# Altium project H2_transmitter_v4.PrjPcb
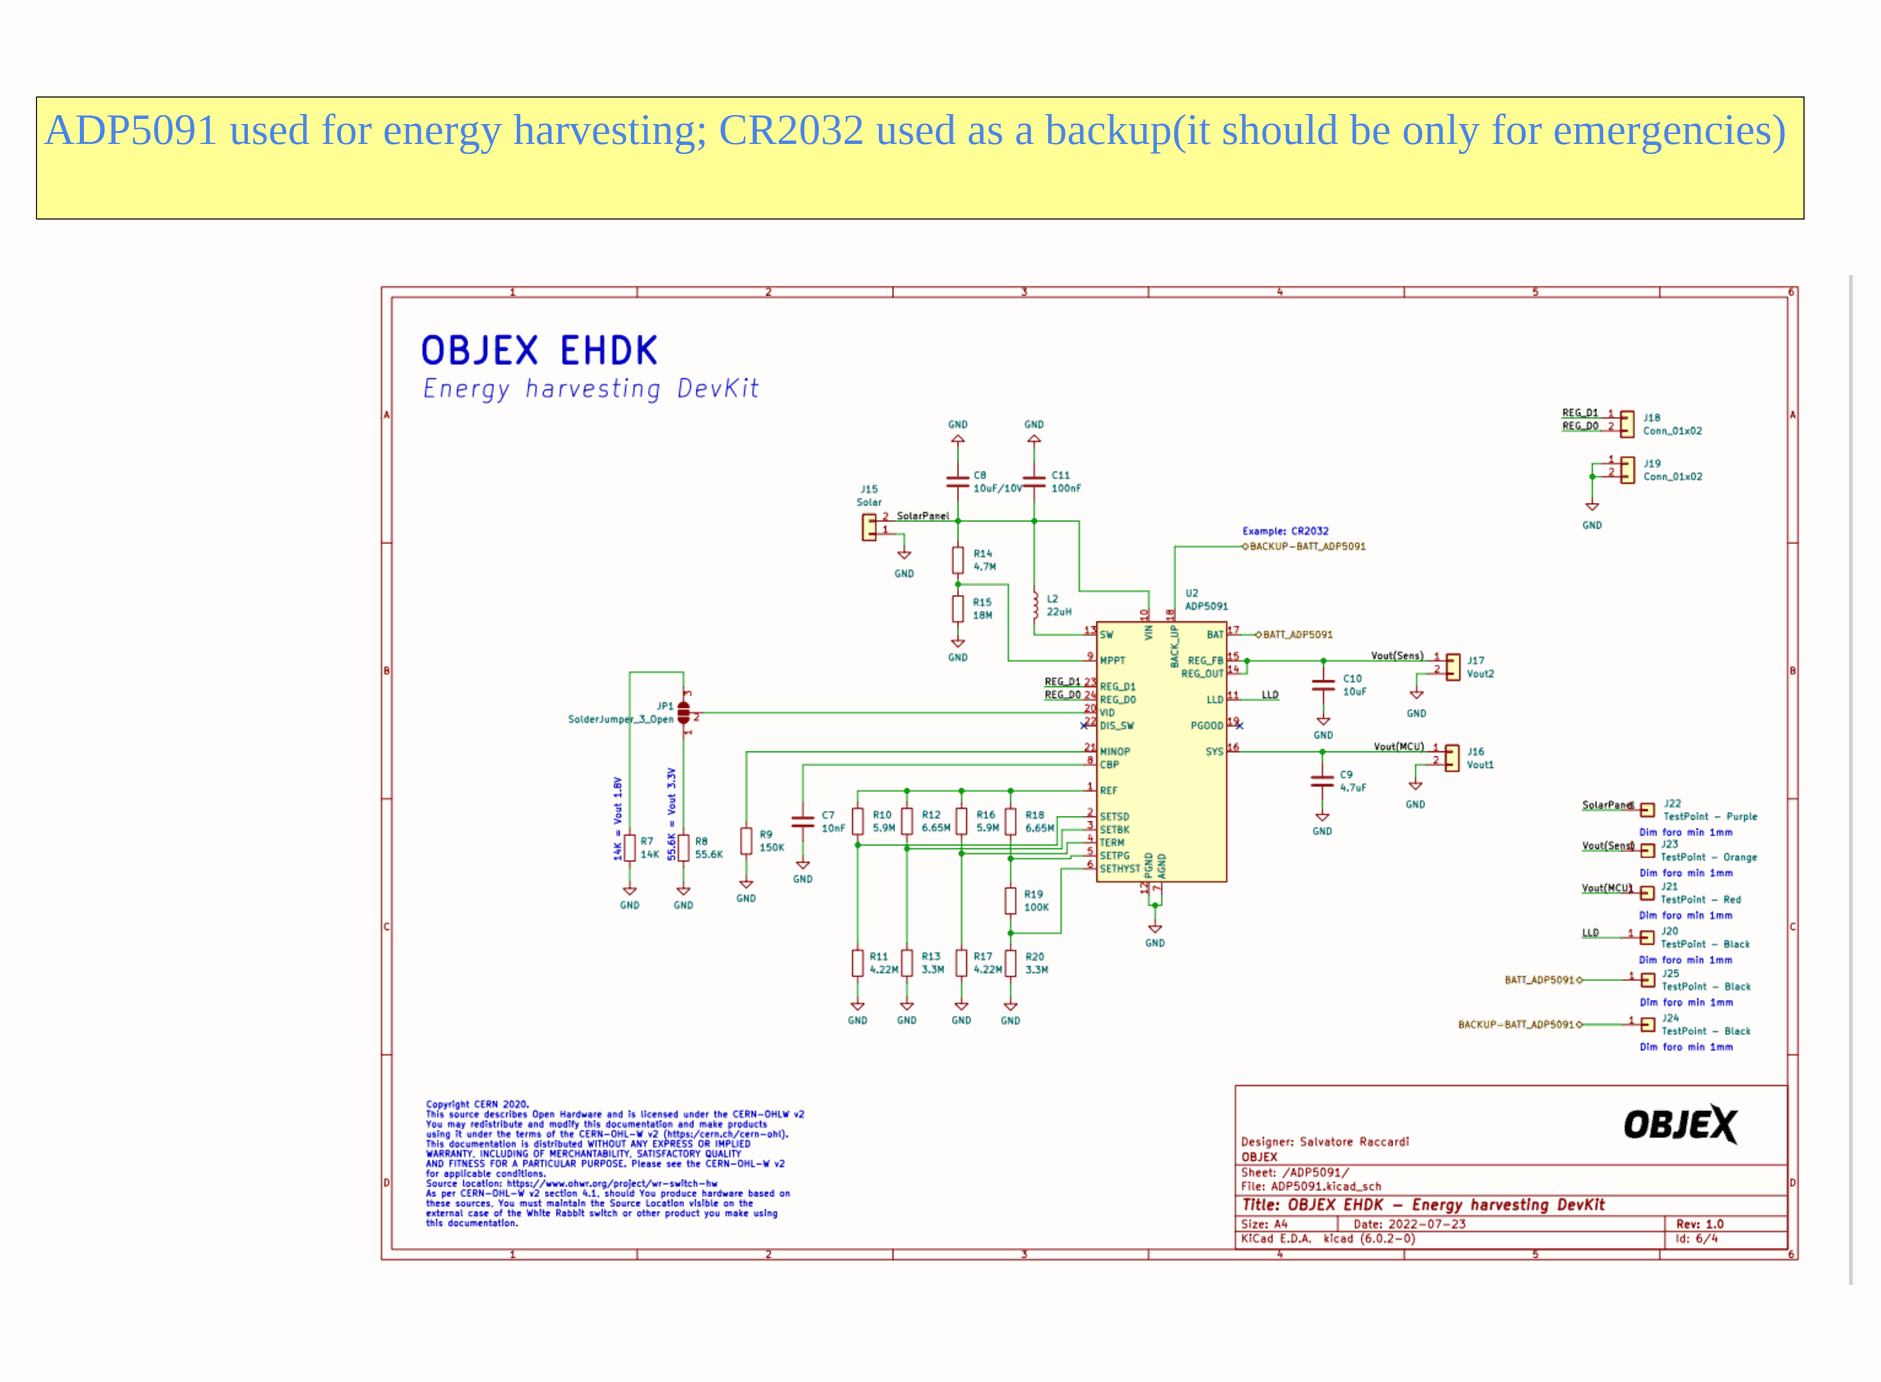
[diagram p0: 1_Power.SchDoc, left]
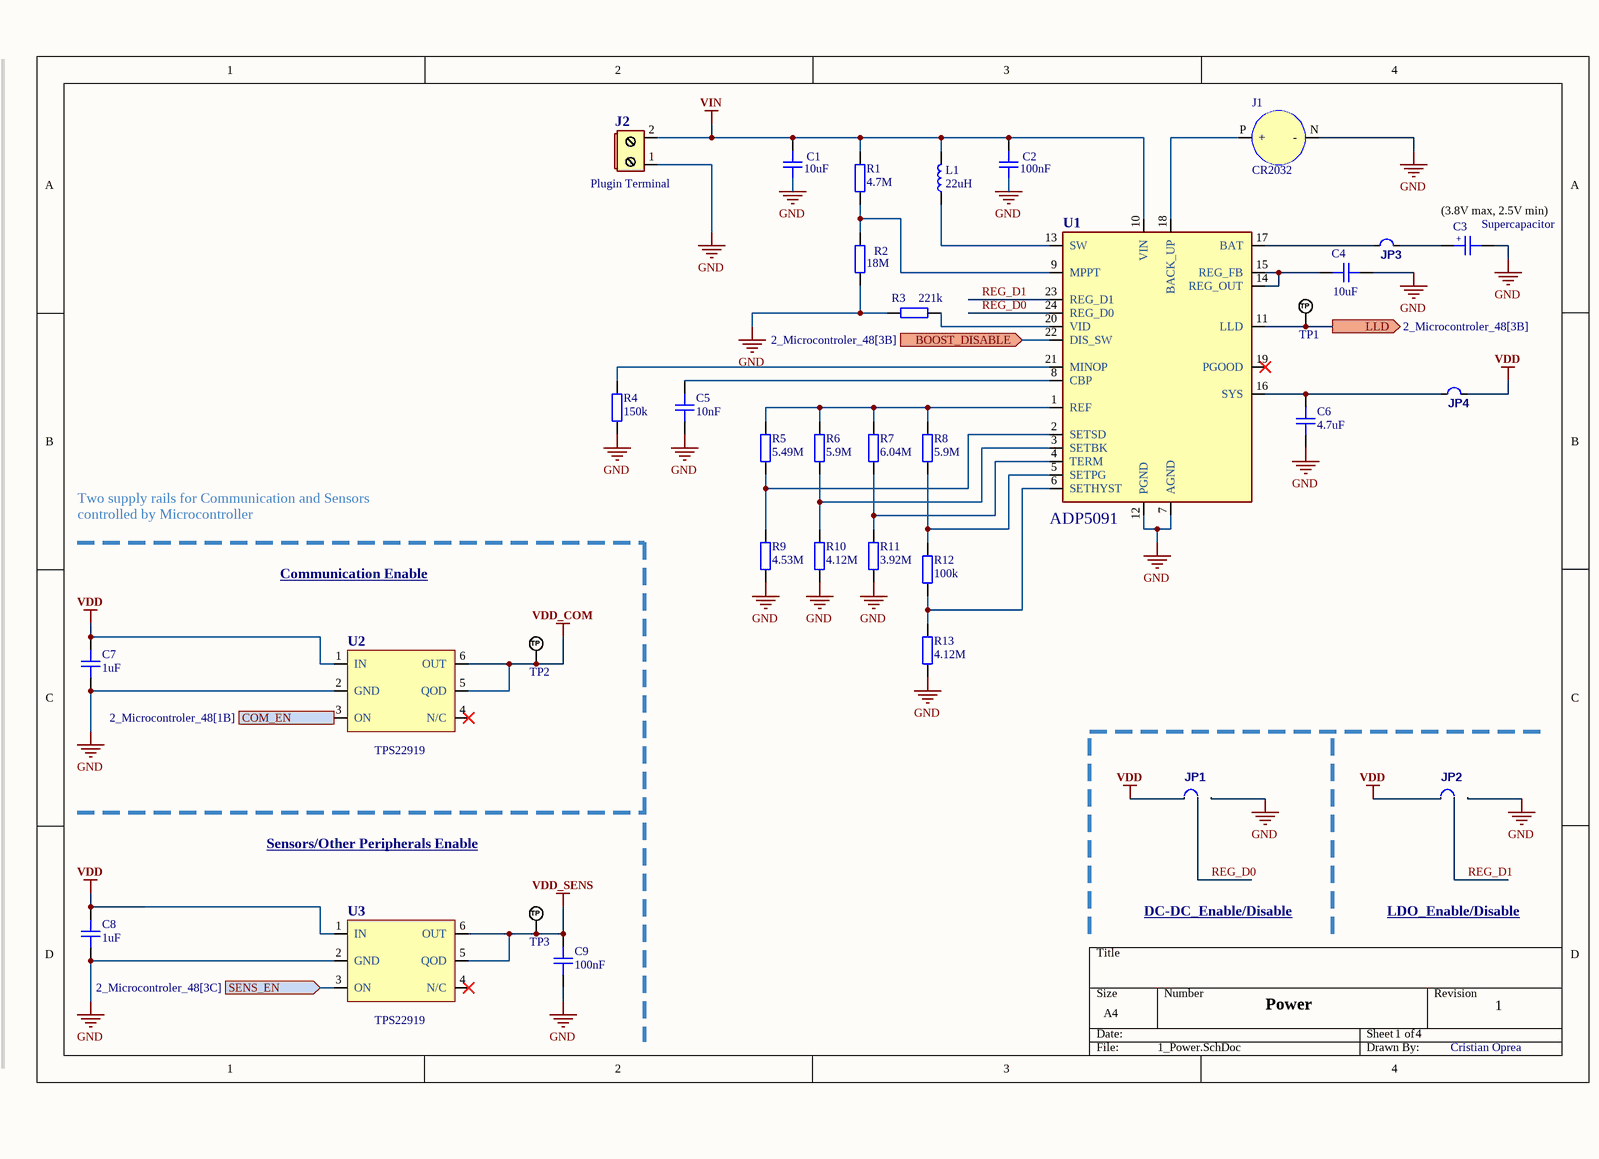
[diagram p1: 1_Power.SchDoc, middle]
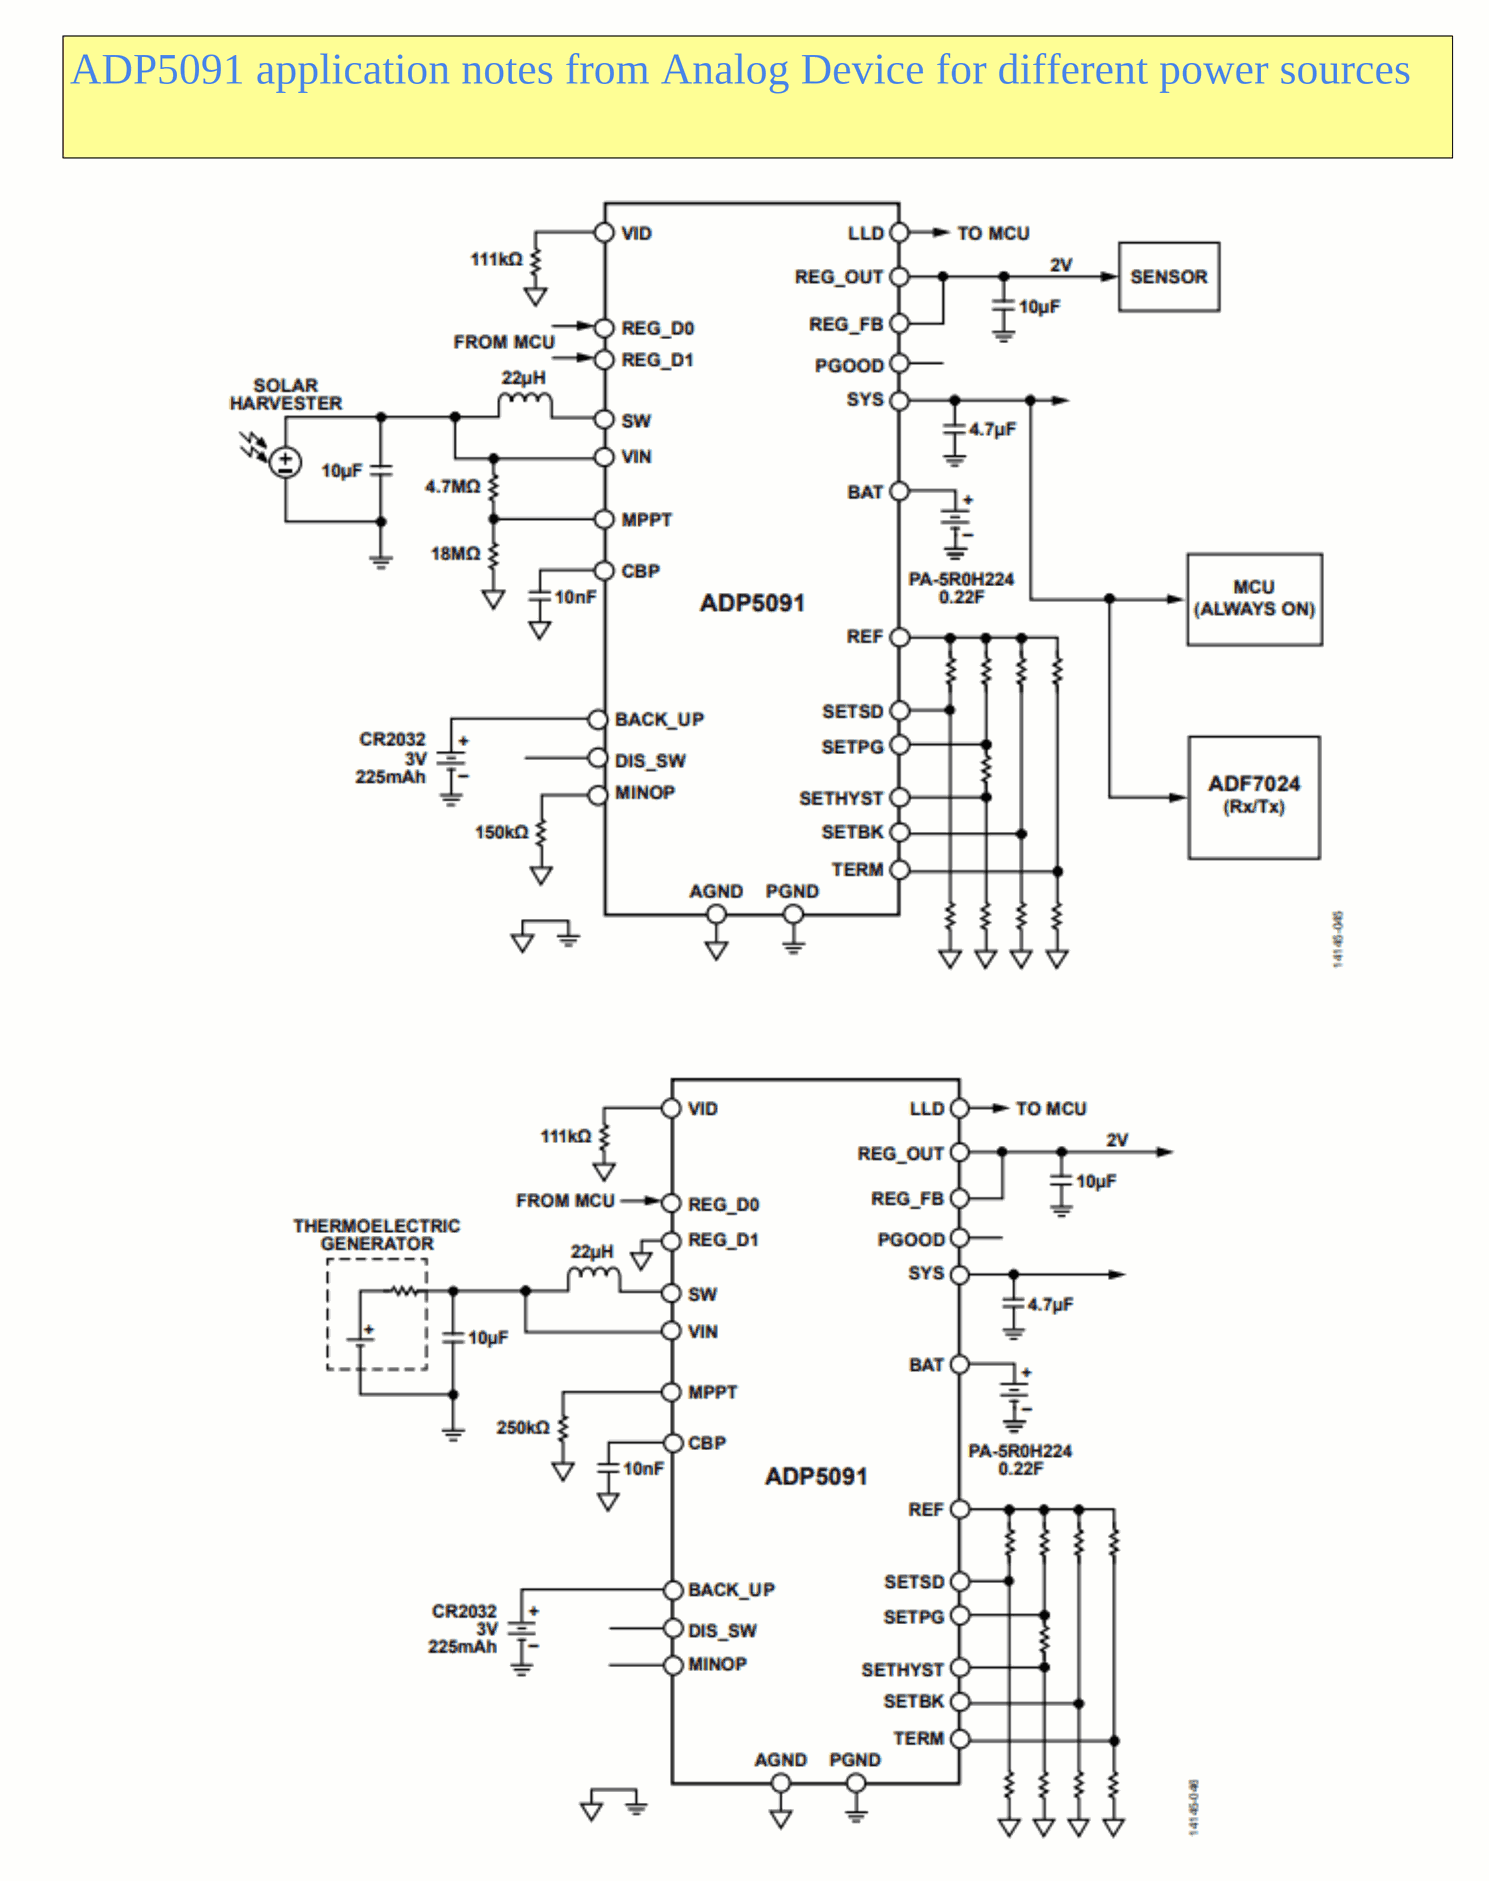
[diagram p2: 1_Power.SchDoc, right]
2 sheets, 58 parts. Net scope: flat (ports and power ports of the same name join across sheets).
Board file: PCB1.PcbDoc
Sheets:
  1_Power.SchDoc
  3_Communication.SchDoc

## Sheet 1_Power.SchDoc: Power
size A4; DrawnBy: Cristian Oprea; Revision: 1; SheetNumber: 1; SheetTotal: 4

### Parts
C1  10uF  [C0603]
C2  100nF  [C0603]
C3  Supercapacitor  [CAP_POL_8x16x3.5]
C4  10uF  [C0603]
C5  10nF  [C0603]
C6  4.7uF  [C0603]
C7  1uF  [C0603]
C8  1uF  [C0603]
C9  100nF  [C0603]
J1  CR2032  [BAT_CR2032-BS-6-1]
J2  Plugin Terminal  [2.54_pluggable_terminal]
JP1  JUMPER_3PIN  [HEADER_1x3_2.54]  (value not drawn)
JP2  JUMPER_3PIN  [HEADER_1x3_2.54]  (value not drawn)
JP3  JUMPER  [HEADER_1x2_2.54]  (value not drawn)
JP4  JUMPER  [HEADER_1x2_2.54]  (value not drawn)
L1  22uH  [IND_3.2_4]
R1  4.7M  [R0603]
R2  18M  [R0603]
R3  221k  [R0603]
R4  150k  [R0603]
R5  5.49M  [R0603]
R6  5.9M  [R0603]
R7  6.04M  [R0603]
R8  5.9M  [R0603]
R9  4.53M  [R0603]
R10  4.12M  [R0603]
R11  3.92M  [R0603]
R12  100k  [R0603]
R13  4.12M  [R0603]
TP1  TP_NOBOM  [TEST_PAD_THD]  (value not drawn)  (no BOM)
TP2  TP_NOBOM  [TEST_PAD_THD]  (value not drawn)  (no BOM)
TP3  TP_NOBOM  [TEST_PAD_THD]  (value not drawn)  (no BOM)
U1  ADP5091  [LFCSP-24]
U2  TPS22919  [SC70-6]
U3  TPS22919  [SC70-6]

### Ports
BOOST_DISABLE (in, see 2_Microcontroler_48[3B]), COM_EN (in, see 2_Microcontroler_48[1B]), LLD (out, see 2_Microcontroler_48[3B]), SENS_EN (in, see 2_Microcontroler_48[3C])

### Nets
GND: C1.1 C2.1 C3.2 C4.2 C5.1 C6.1 C7.1 C8.1 C9.1 J1.N(-) J2.1 JP1.3 JP2.3 R2.1 R3.1 R4.1 R9.1 R10.1 R11.1 R13.1 U1.7(AGND) U1.12(PGND) U2.2(GND) U3.2(GND)
VDD: C7.2 C8.2 JP1.1 JP2.1 JP4.2 U2.1(IN) U3.1(IN)
VDD_COM: TP2.1(TP) U2.5(QOD) U2.6(OUT)
VDD_SENS: C9.2 TP3.1(TP) U3.5(QOD) U3.6(OUT)
VIN: C1.2 C2.2 J2.2 L1.2 R1.2 U1.10(VIN)
REG_D0: JP1.2 U1.24(REG_D0)
REG_D1: JP2.2 U1.23(REG_D1)
NetC3_1: C3.1 JP3.2
NetC4_1: C4.1 U1.14(REG_OUT) U1.15(REG_FB)
NetC5_2: C5.2 U1.8(CBP)
NetC6_2: C6.2 JP4.1 U1.16(SYS)
NetJ1_P: J1.P(+) U1.18(BACK_UP)
NetJP3_1: JP3.1 U1.17(BAT)
NetL1_1: L1.1 U1.13(SW)
NetR1_1: R1.1 R2.2 U1.9(MPPT)
NetR3_2: R3.2 U1.20(VID)
NetR4_2: R4.2 U1.21(MINOP)
NetR5_1: R5.1 R9.2 U1.2(SETSD)
NetR5_2: R5.2 R6.2 R7.2 R8.2 U1.1(REF)
NetR6_1: R6.1 R10.2 U1.3(SETBK)
NetR7_1: R7.1 R11.2 U1.4(TERM)
NetR8_1: R8.1 R12.2 U1.5(SETPG)
NetR12_1: R12.1 R13.2 U1.6(SETHYST)
NetTP1_1: TP1.1(TP) U1.11(LLD) ; port LLD
NetU1_22: U1.22(DIS_SW) ; port BOOST_DISABLE
NetU2_3: U2.3(ON) ; port COM_EN
NetU3_3: U3.3(ON) ; port SENS_EN

Not connected (* = marked no-connect by the designer): U1 19(PGOOD)*; U2 4(N/C)*; U3 4(N/C)*

### Notes on the sheet
- ADP5091 application notes from Analog Device for different power sources
- ADP5091 used for energy harvesting; CR2032 used as a backup(it should be only for emergencies)
- (near J2) 0.08V to 3.6V input
- R1 not populated for TEG generators
- (near C3) (3.8V max, 2.5V min)
- VID resistor for setting output voltage
- Low Light Density (low voltage at input), PGOOD is HIGH only when output voltage is higher than the set voltage
- Two supply rails for Communication and Sensors controlled by Microcontroller
- Vsetbk = 2.4V (backup supply swith on threshold)(higher than stop discharge threshold)
- (near R11) Vbat_term = 3.8V (stop charge threshold) (hybrid supercapacitor with lithium)
- Communication Enable
- Vsetsd = 2.2V (stop discharge threshold) (hybrid supercapacitor with lithium)
- Vsetbkhys = (hysteresis threshold)
- (near JP4) Floating: VOUT = 2.5 V
  RVID = 7 kΩ: VOUT = 1.5 V
  RVID = 14 kΩ: VOUT = 1.8 V
  RVID = 27.7 kΩ: VOUT = 3.6 V
  RVID = 55.6 kΩ:VOUT = 3.3 V
  RVID = 111 kΩ: VOUT = 2.0 V
  RVID = 221 kΩ: VOUT = 3.0 V
  RVID = 442 kΩ: VOUT = 2.8 V
- (near R13) Vsetpg = 2.4V (power good threshold) (voltage output is higher than this threshold)
- Sensors/Other Peripherals Enable
- DC-DC_Enable/Disable
- LDO_Enable/Disable
- (in symbol Supercapacitor) +

### Library data of the parts
C1 C2 C4-C9 = CAP_0603: Capacitor SMD 0603; Manufacturer: *; Manufacturer Part Number: *; Distributor Link: *; LCSC: *; Rating: *; Dielectric: *
J1 = CR2032-BS-6-1: CR2032 Coin Cell Battery Holder; Manufacturer: Q&J; Manufacturer Part Number: CR2032-BS-6-1
J2 = Power_Connector: Screw terminal or plug terminal for power
JP1 JP2 = JUMPER_3PIN: *; PackageReference: *; Manufacturer Part Number 1: *
JP3 JP4 = JUMPER: *; PackageReference: *; Manufacturer Part Number 1: *
L1 = IND_1008: Inductor SMD 1008
R1-R13 = RES_0603: Resistor SMD 0603; Manufacturer: *; Manufacturer Part Number: *; Distributor Link: *; LCSC: *
TP1-TP3 = TEST_POINT_RND_1MM: Test Point Round 1mm (NO BOM)
U1 = ADP5091: Ultralow Power Energy Harvester PMUs / with MPPT and Charge Management and BAckup Supply
U2 U3 = TPS22919: 5.5-V, 1.5-A, 90-mΩ load switch with adjustable output discharge
C3 = Supercapacitor: Manufacturer: *; Manufacturer Part Number: *; Distributor Link: *; LCSC: *

## Sheet 3_Communication.SchDoc: Communication
size A4; DrawnBy: Cristian Oprea; Revision: 1; SheetNumber: 3; SheetTotal: 4
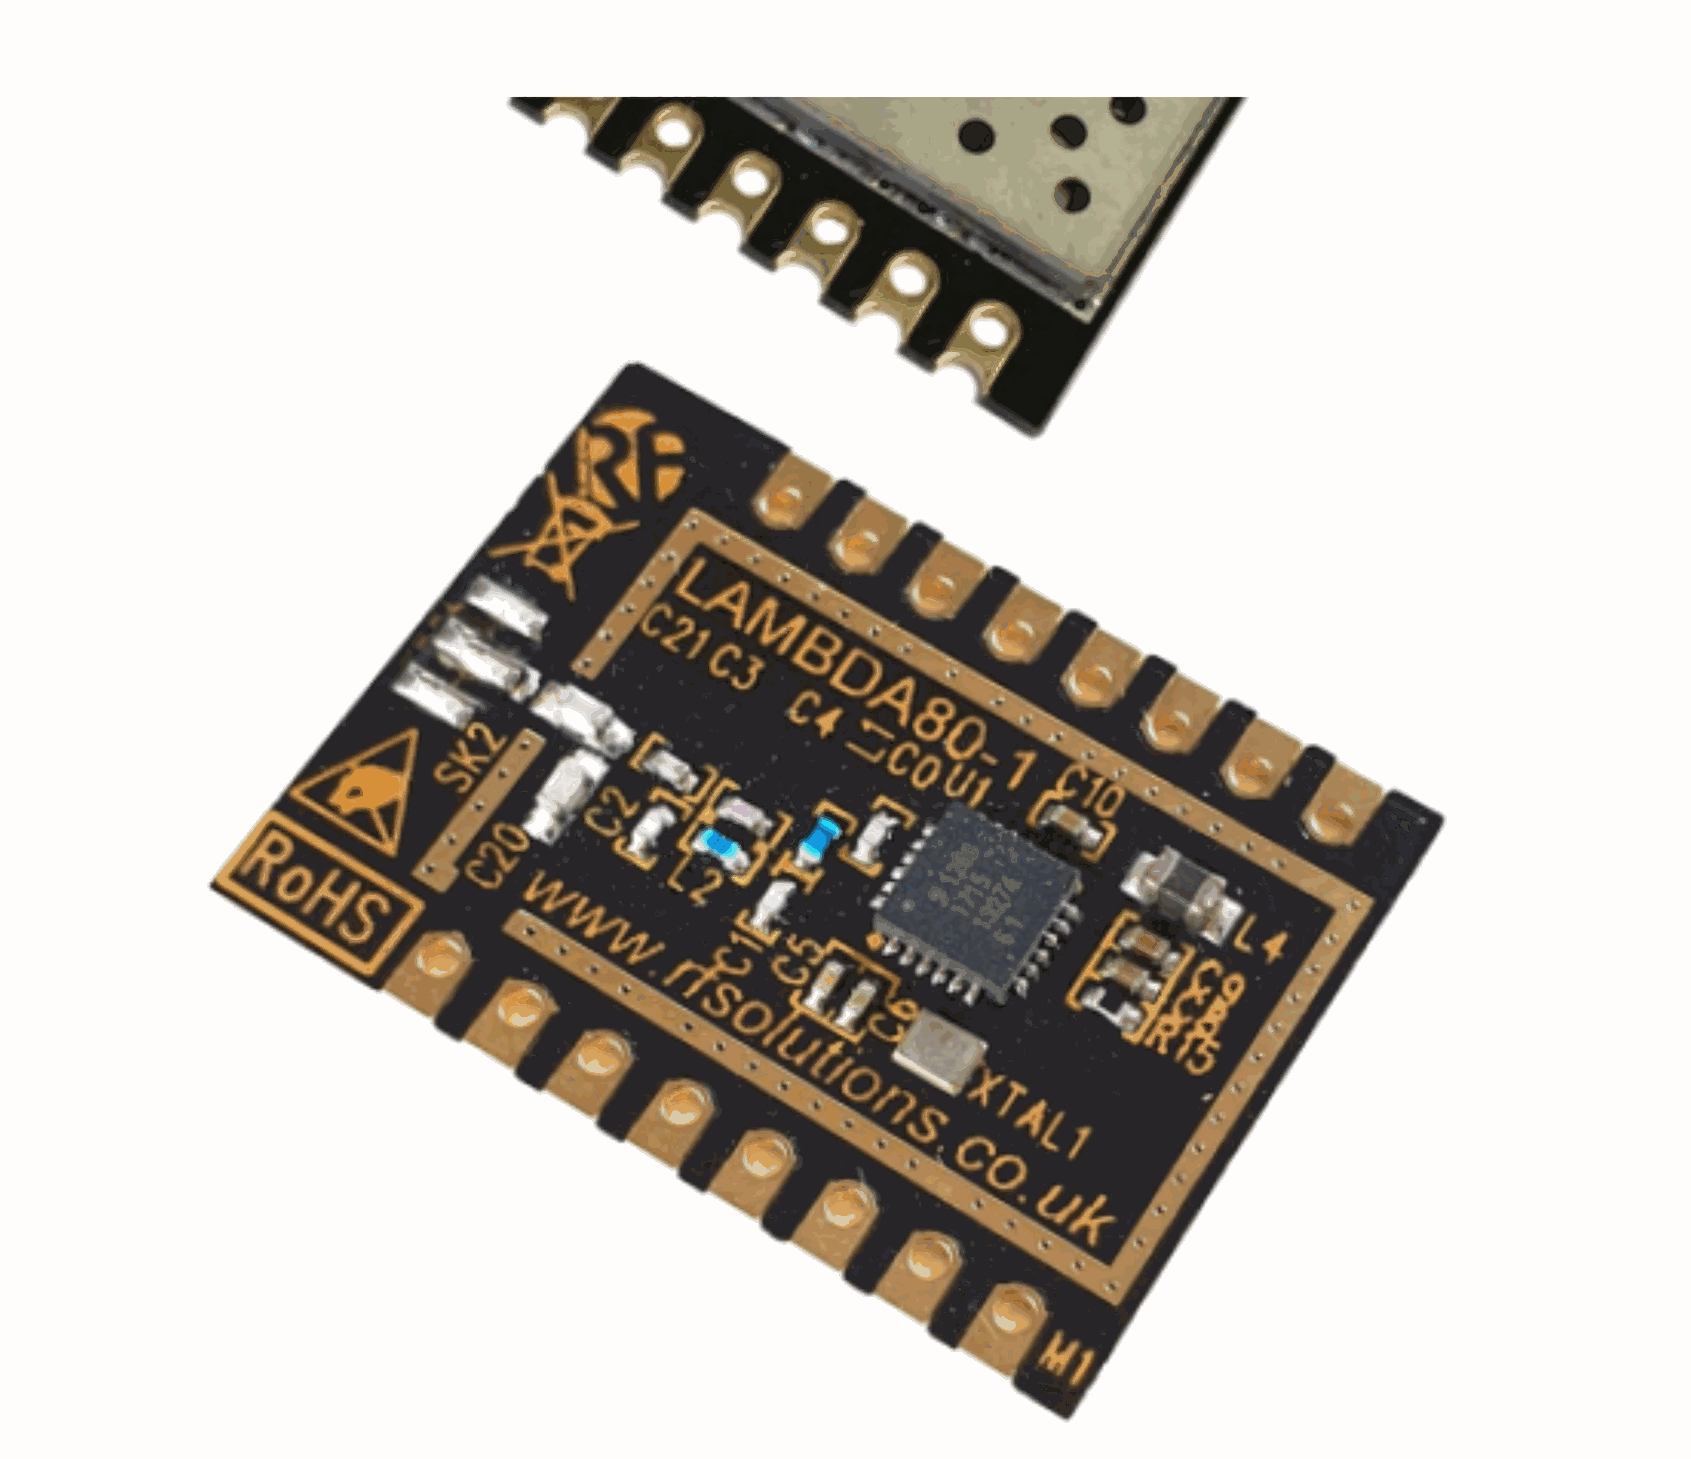
[diagram p3: 3_Communication.SchDoc, top middle]
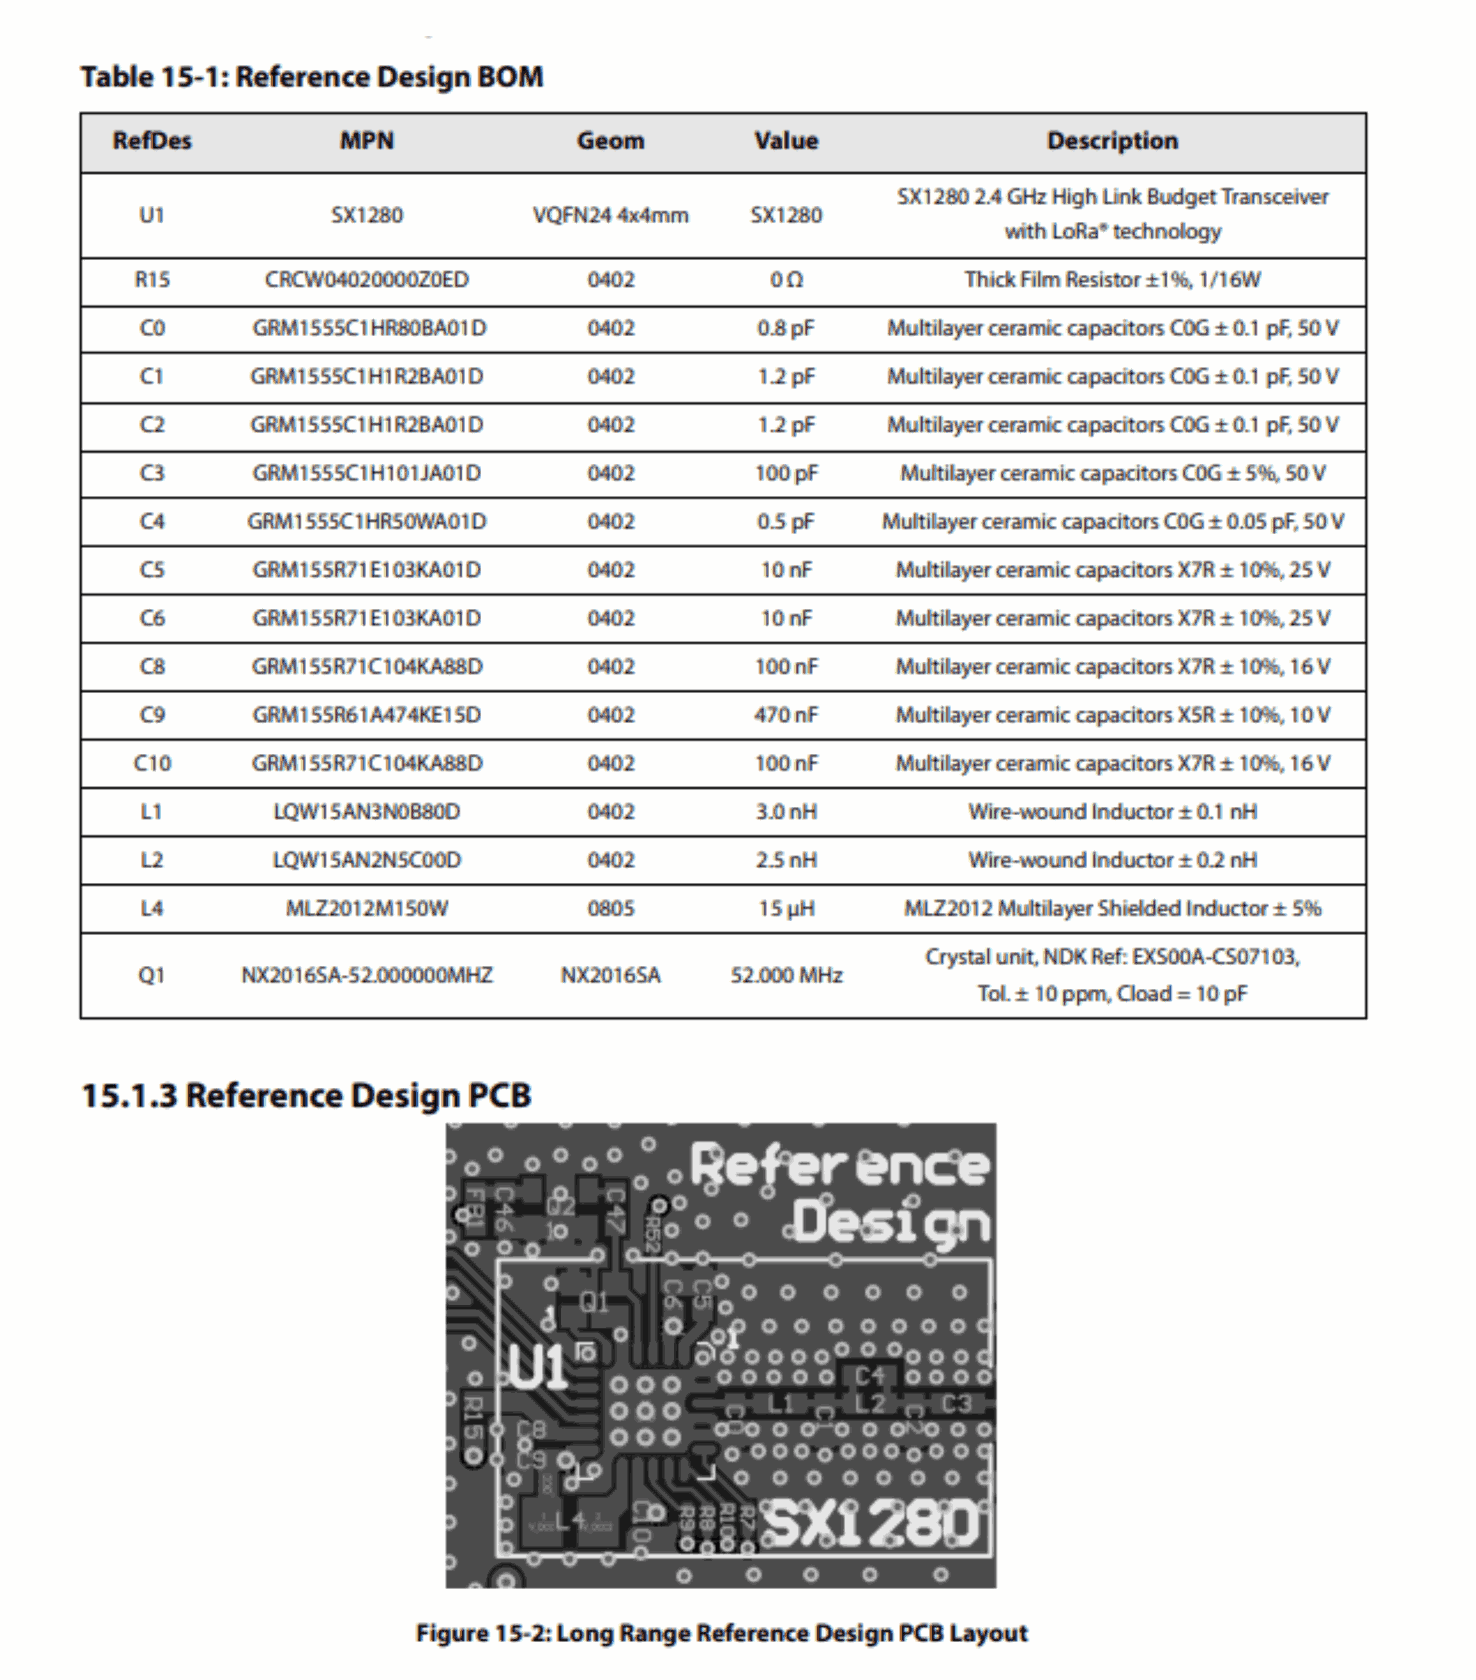
[diagram p4: 3_Communication.SchDoc, top right]
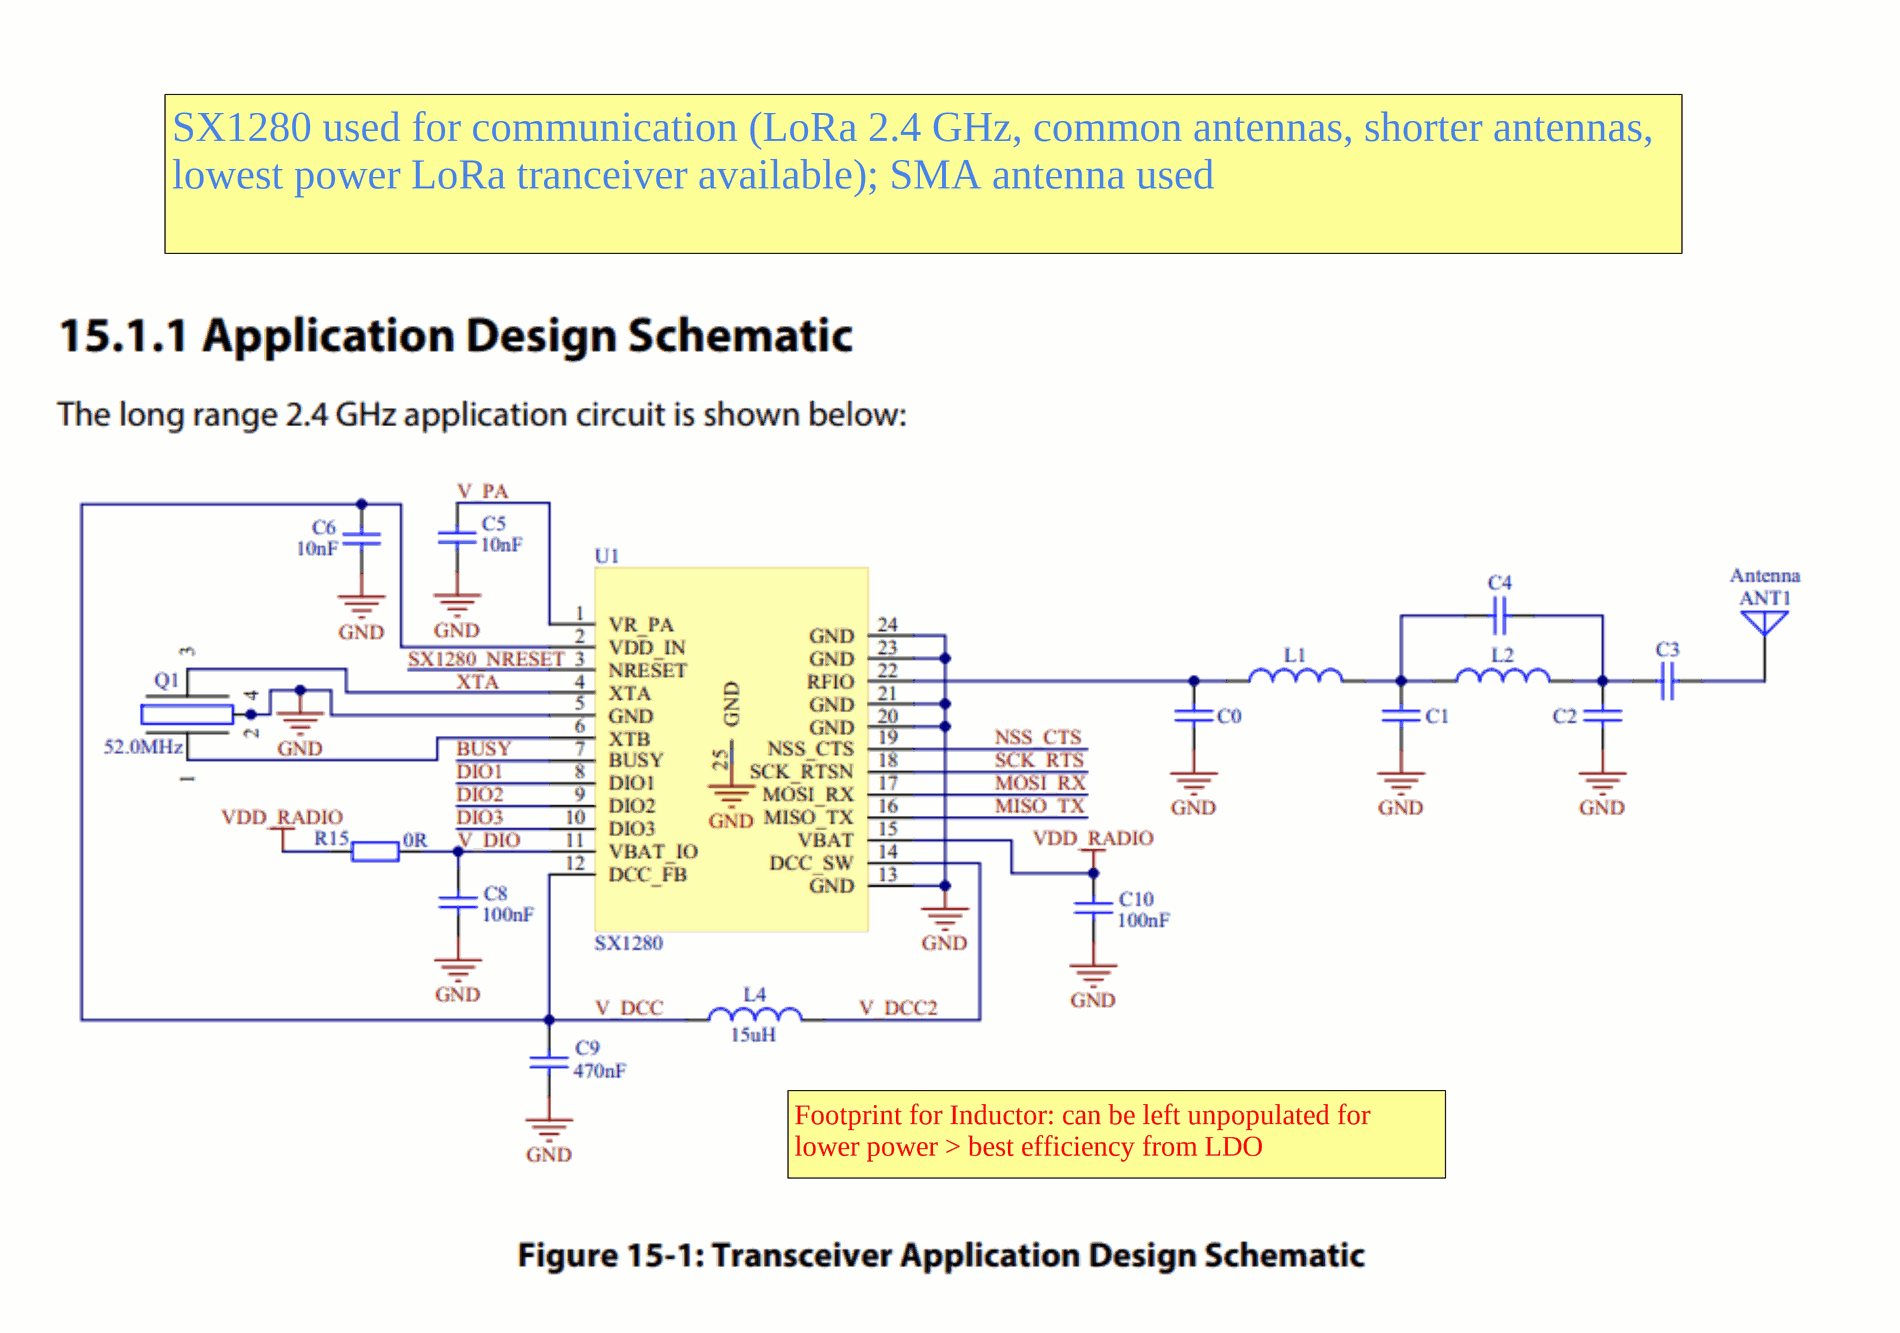
[diagram p5: 3_Communication.SchDoc, bottom left]
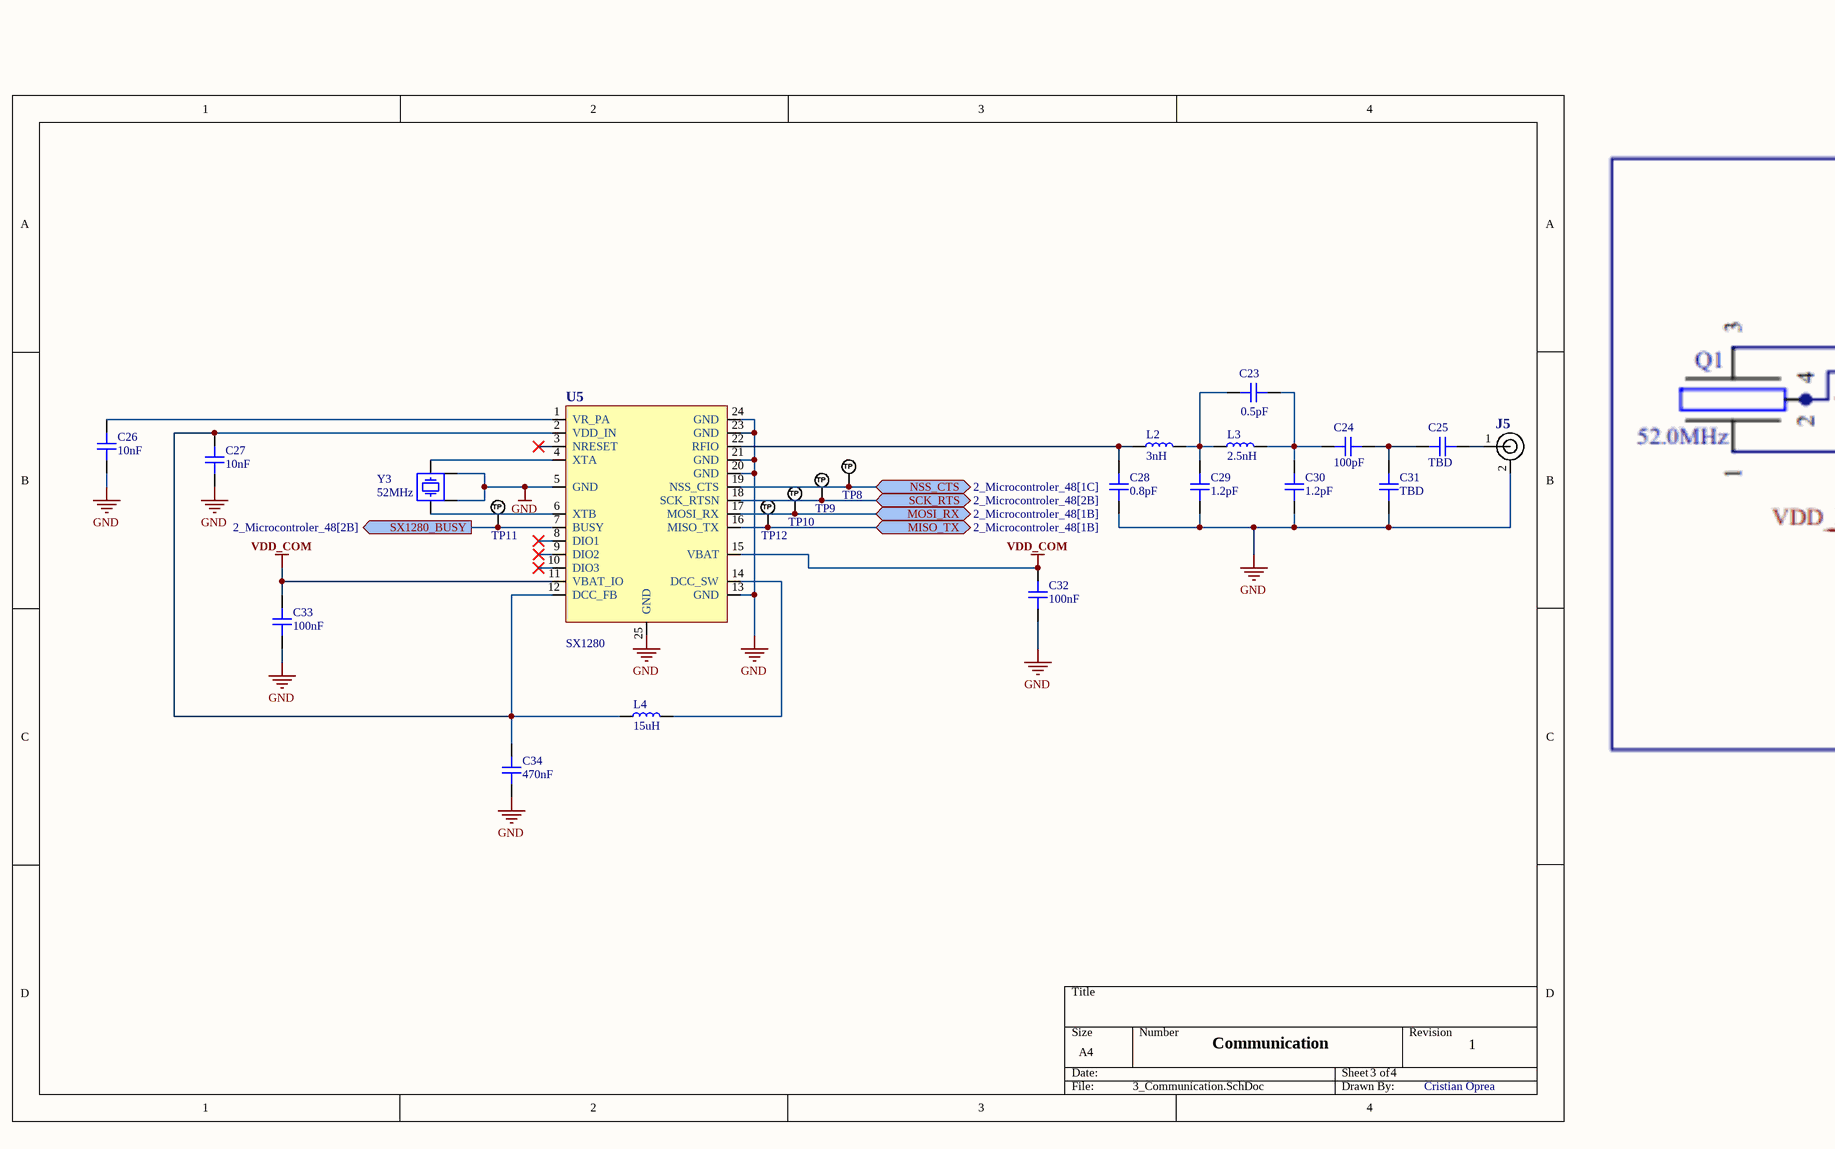
[diagram p6: 3_Communication.SchDoc, bottom middle]
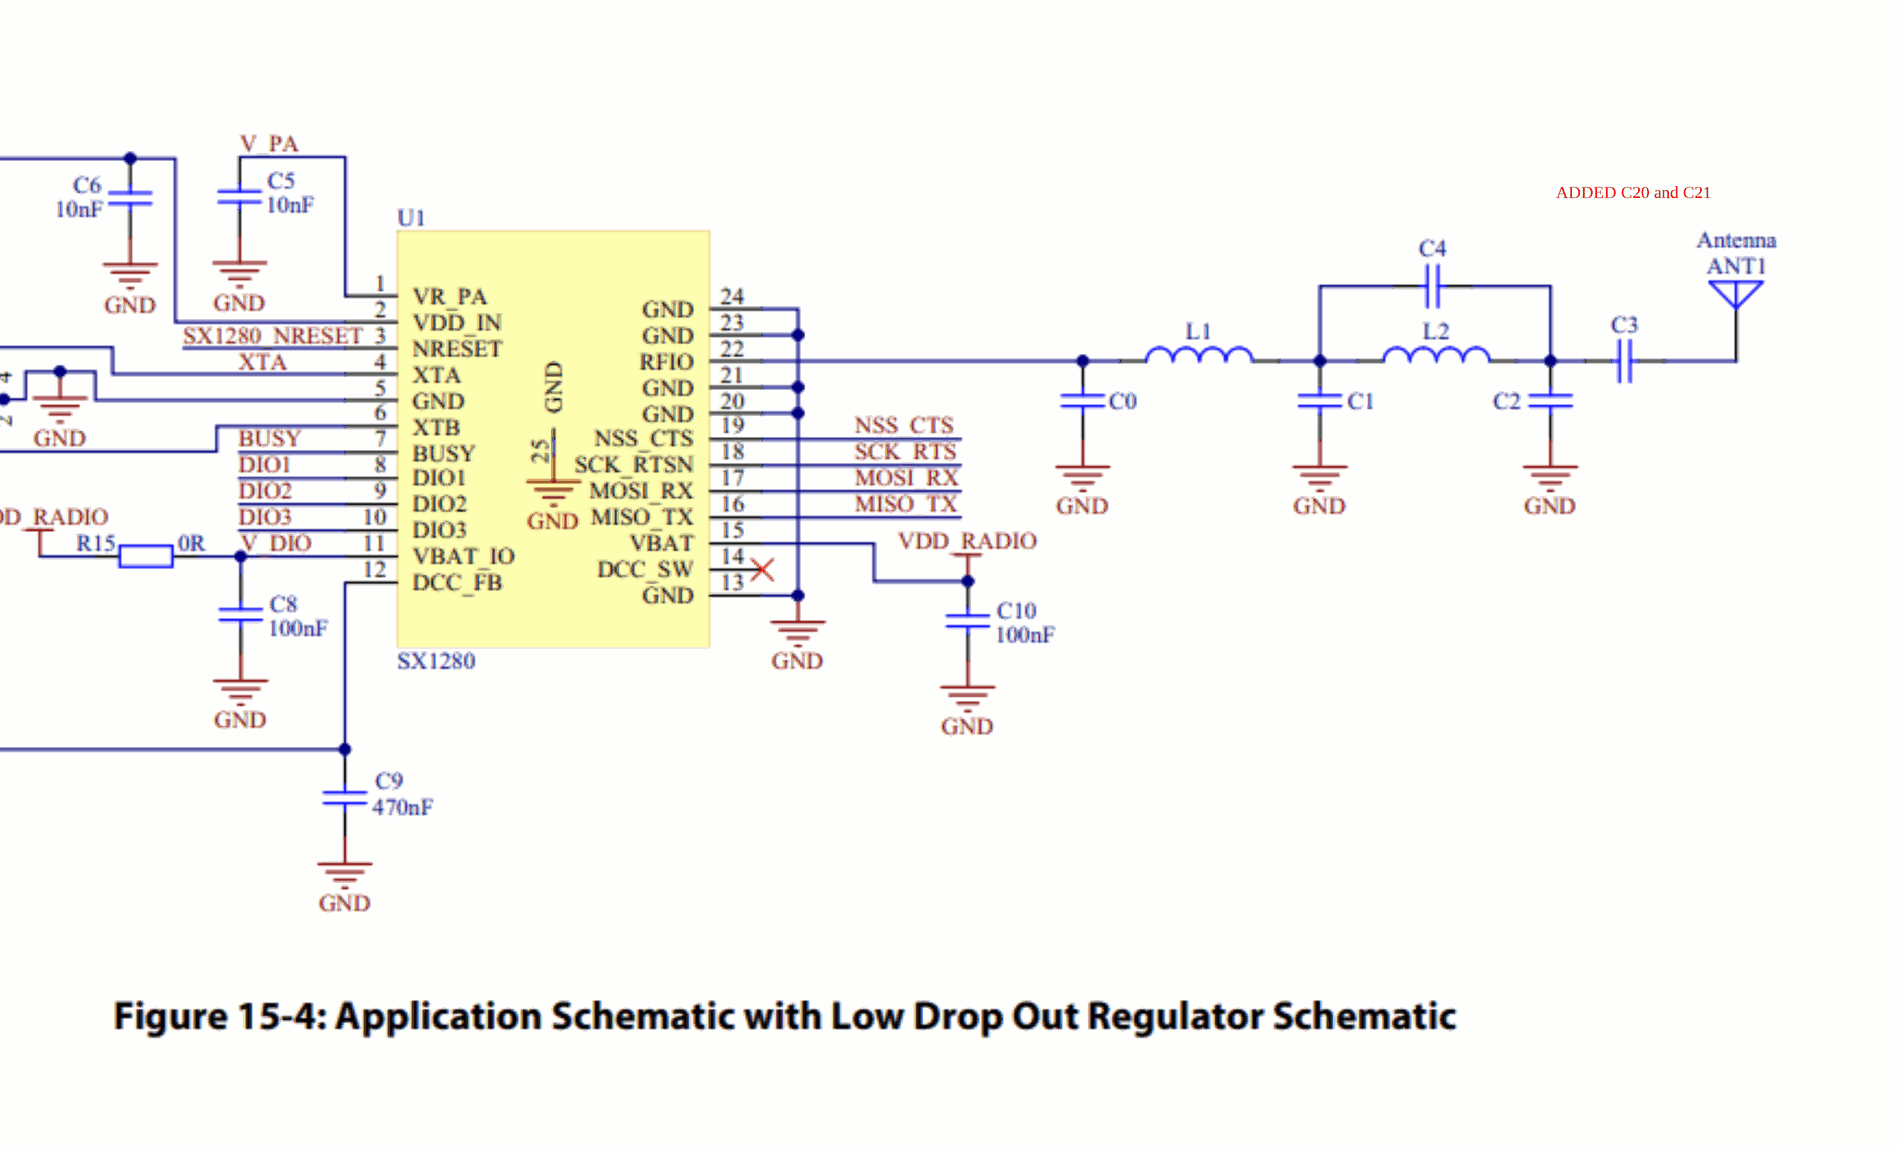
[diagram p7: 3_Communication.SchDoc, bottom right]

### Parts
C23  0.5pF  [C0603]
C24  100pF  [C0603]
C25  TBD  [C0805]
C26  10nF  [C0603]
C27  10nF  [C0603]
C28  0.8pF  [C0603]
C29  1.2pF  [C0603]
C30  1.2pF  [C0603]
C31  TBD  [C0805]
C32  100nF  [C0603]
C33  100nF  [C0603]
C34  470nF  [C0603]
J5  SMA_EDGE_CONN  [CON_SMA-EDGE-S]  (value not drawn)
L2  3nH  [R0603]
L3  2.5nH  [R0603]
L4  15uH  [IND_3.2_4]
TP8  TP_NOBOM  [TEST_PAD_THD]  (value not drawn)  (no BOM)
TP9  TP_NOBOM  [TEST_PAD_THD]  (value not drawn)  (no BOM)
TP10  TP_NOBOM  [TEST_PAD_THD]  (value not drawn)  (no BOM)
TP11  TP_NOBOM  [TEST_PAD_THD]  (value not drawn)  (no BOM)
TP12  TP_NOBOM  [TEST_PAD_THD]  (value not drawn)  (no BOM)
U5  SX1280  [QFN-24_4x4_0.5]
Y3  52MHz  [CRYSTAL_2016_4P]

### Ports
MISO_TX (bidir, see 2_Microcontroler_48[1B]), MOSI_RX (bidir, see 2_Microcontroler_48[1B]), NSS_CTS (bidir, see 2_Microcontroler_48[1C]), SCK_RTS (bidir, see 2_Microcontroler_48[2B]), SX1280_BUSY (out, see 2_Microcontroler_48[2B])

### Nets
GND: C26.1 C27.1 C28.1 C29.1 C30.1 C31.1 C32.1 C33.1 C34.1 J5.2 U5.5(GND) U5.13(GND) U5.20(GND) U5.21(GND) U5.23(GND) U5.24(GND) U5.25(GND) Y3.2 Y3.4
VDD_COM: C32.2 C33.2 U5.11(VBAT_IO) U5.15(VBAT)
NetC23_1: C23.1 C24.2 C30.2 L3.2
NetC23_2: C23.2 C29.2 L2.2 L3.1
NetC24_1: C24.1 C25.2 C31.2
NetC25_1: C25.1 J5.1
NetC26_2: C26.2 U5.1(VR_PA)
NetC27_2: C27.2 C34.2 L4.1 U5.2(VDD_IN) U5.12(DCC_FB)
NetC28_2: C28.2 L2.1 U5.22(RFIO)
NetL4_2: L4.2 U5.14(DCC_SW)
NetTP8_1: TP8.1(TP) U5.19(NSS_CTS) ; port NSS_CTS
NetTP9_1: TP9.1(TP) U5.18(SCK_RTSN) ; port SCK_RTS
NetTP10_1: TP10.1(TP) U5.17(MOSI_RX) ; port MOSI_RX
NetTP11_1: TP11.1(TP) U5.7(BUSY) ; port SX1280_BUSY
NetTP12_1: TP12.1(TP) U5.16(MISO_TX) ; port MISO_TX
NetU5_4: U5.4(XTA) Y3.3
NetU5_6: U5.6(XTB) Y3.1

Not connected (* = marked no-connect by the designer): U5 3(NRESET)* 8(DIO1)* 9(DIO2)* 10(DIO3)*

### Notes on the sheet
- SX1280 used for communication (LoRa 2.4 GHz, common antennas, shorter antennas, lowest power LoRa tranceiver available); SMA antenna used
- ADDED C20 and C21
- impedance matching configurations(40R to 50R after C25)
- (near J5) Values based on antenna input impedance; capacitors to ground can be left unpopullated, inductors or series capacitors can be swaped with 0R resistors or shunts
- (near J5) last 2 capacitors are for impedance matching for certain antenna
- Footprint for Inductor: can be left unpopulated for lower power > best efficiency from LDO

### Library data of the parts
C23 C24 C26-C30 C32-C34 = CAP_0603: Capacitor SMD 0603; Manufacturer: *; Manufacturer Part Number: *; Distributor Link: *; LCSC: *; Rating: *; Dielectric: *
C25 C31 = CAP_0603: Capacitor SMD 0805; Manufacturer: *; Manufacturer Part Number: *; Distributor Link: *; LCSC: *; Rating: *; Dielectric: *
J5 = CON-SMA-EDGE-S: RF Connector SMA Female 50 Ohms 18 GHz PCB Edge Mount; Manufacturer: RF Solutions; Manufacturer Part Number: CON-SMA-EDGE-S
L2-L4 = IND_0603: Inductor SMD 0603
TP8-TP12 = TEST_POINT_RND_1MM: Test Point Round 1mm (NO BOM)
U5 = SX1280: Low power LoRa transceiver operating at 2.4GHz with ranging capability
Y3 = Crystal: Manufacturer: Epson; Manufacturer Part Number: TSX-3225 24.0000MF15X-AC

## Nets that join several sheets
GND: 1_Power (24 pins), 3_Communication (19 pins)
VDD_COM: 1_Power (TP2.1 U2.5 U2.6), 3_Communication (C32.2 C33.2 U5.11 U5.15)